# Altium schematic sheet Connectors.SchDoc
size A4
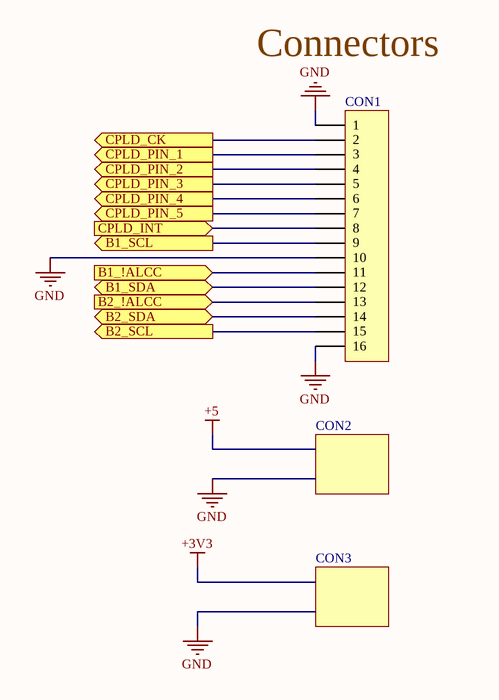
[diagram p0: Connectors.SchDoc]

## Parts
CON1  Header 16  [HDR1X16]  (value not drawn)
CON2  Bornier_1  [Block_2Position]  (value not drawn)
CON3  Bornier_1  [Block_2Position]  (value not drawn)

## Ports
B1_!ALCC (in), B1_SCL (out), B1_SDA (bidir), B2_!ALCC (in), B2_SCL (out), B2_SDA (bidir), CPLD_CK (out), CPLD_INT (in), CPLD_PIN_1 (out), CPLD_PIN_2 (out), CPLD_PIN_3 (out), CPLD_PIN_4 (out), CPLD_PIN_5 (out)

## Nets
+3V3: CON3.1
+5: CON2.1
GND: CON1.1 CON1.10 CON1.16 CON2.2 CON3.2
B1_!ALCC: CON1.11 ; port B1_!ALCC
B1_SCL: CON1.9 ; port B1_SCL
B1_SDA: CON1.12 ; port B1_SDA
B2_!ALCC: CON1.13 ; port B2_!ALCC
B2_SCL: CON1.15 ; port B2_SCL
B2_SDA: CON1.14 ; port B2_SDA
CPLD_CK: CON1.2 ; port CPLD_CK
CPLD_INT: CON1.8 ; port CPLD_INT
CPLD_PIN_1: CON1.3 ; port CPLD_PIN_1
CPLD_PIN_2: CON1.4 ; port CPLD_PIN_2
CPLD_PIN_3: CON1.5 ; port CPLD_PIN_3
CPLD_PIN_4: CON1.6 ; port CPLD_PIN_4
CPLD_PIN_5: CON1.7 ; port CPLD_PIN_5

## Notes on the sheet
- Connectors
- Title
- Size:
- Date:
- Battery Management System
- A4
- Number:
- Time:
- 1
- Revision:
- Author: GEI Corp
- V1.0
- GEI Corp
- 135 avenue de Rangueil
- INSA Toulouse
- 31400 Toulouse
- FRANCE
- File:
- Projet_Inter_1\BMS_GEI_CORP

## Library data of the parts
CON1 = Header 16: Header, 16-Pin; LatestRevisionDate: 17-Jul-2002; LatestRevisionNote: Re-released for DXP Platform.; Publisher: Altium Limited
CON2 CON3 = Bornier_1: Bornier à vis